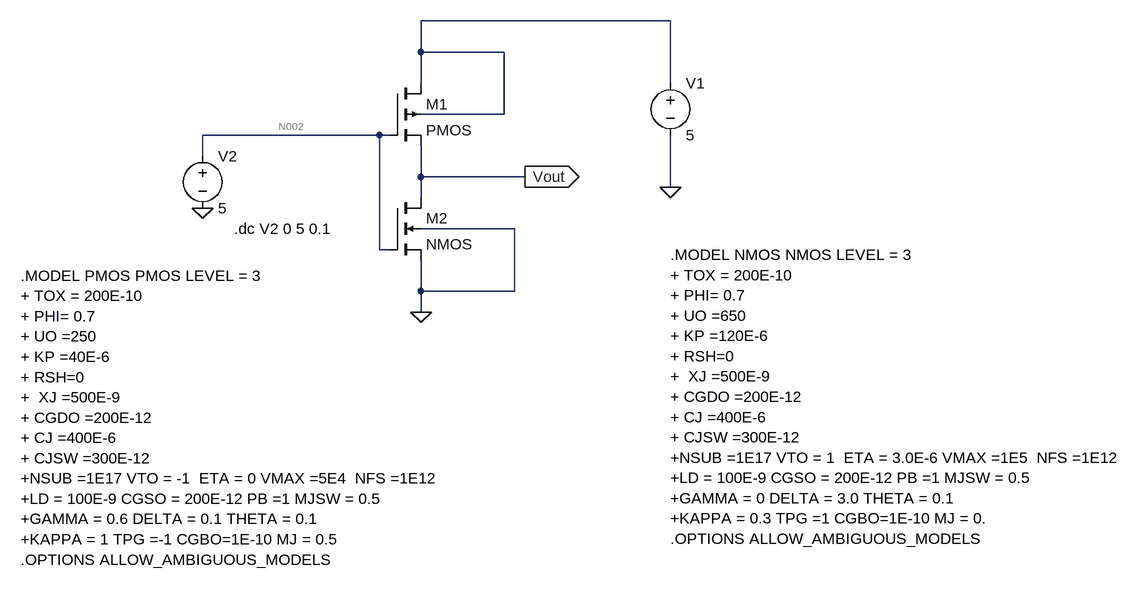
[diagram p0: schematic Voltage Transfer Characteristic curve of CMOS.asc]
Voltage Transfer Characteristic curve of CMOS.asc, the LTspice schematic file:
Version 4.1
SHEET 1 1332 752
WIRE 608 -48 224 -48
WIRE 224 0 224 -48
WIRE 352 0 224 0
WIRE 224 48 224 0
WIRE 608 48 608 -48
WIRE 352 96 352 0
WIRE 352 96 224 96
WIRE 160 128 -112 128
WIRE 176 128 160 128
WIRE -112 160 -112 128
WIRE 224 192 224 144
WIRE 384 192 224 192
WIRE 608 208 608 128
WIRE 224 224 224 192
WIRE 368 272 224 272
WIRE 160 304 160 128
WIRE 176 304 160 304
WIRE 224 368 224 320
WIRE 368 368 368 272
WIRE 368 368 224 368
WIRE 224 400 224 368
FLAG 224 400 0
FLAG 608 208 0
FLAG -112 240 0
FLAG 384 192 Vout
IOPIN 384 192 Out
SYMBOL pmos4 176 48 R0
SYMATTR InstName M1
SYMATTR Value2 l=400u w=10u
SYMBOL nmos4 176 224 R0
SYMATTR InstName M2
SYMATTR Value2 l=100u w=10u
SYMBOL voltage 608 32 R0
WINDOW 123 0 0 Left 0
WINDOW 39 0 0 Left 0
SYMATTR InstName V1
SYMATTR Value 5
SYMBOL voltage -112 144 R0
WINDOW 123 0 0 Left 0
WINDOW 39 0 0 Left 0
SYMATTR InstName V2
SYMATTR Value 5
TEXT -392 344 Left 2 !.MODEL PMOS PMOS LEVEL = 3\n+ TOX = 200E-10\n+ PHI= 0.7\n+ UO =250\n+ KP =40E-6\n+ RSH=0\n+  XJ =500E-9\n+ CGDO =200E-12\n+ CJ =400E-6\n+ CJSW =300E-12\n+NSUB =1E17 VTO = -1  ETA = 0 VMAX =5E4  NFS =1E12\n+LD = 100E-9 CGSO = 200E-12 PB =1 MJSW = 0.5\n+GAMMA = 0.6 DELTA = 0.1 THETA = 0.1\n+KAPPA = 1 TPG =-1 CGBO=1E-10 MJ = 0.5\n.OPTIONS ALLOW_AMBIGUOUS_MODELS
TEXT 608 312 Left 2 !.MODEL NMOS NMOS LEVEL = 3\n+ TOX = 200E-10\n+ PHI= 0.7\n+ UO =650\n+ KP =120E-6\n+ RSH=0\n+  XJ =500E-9\n+ CGDO =200E-12\n+ CJ =400E-6\n+ CJSW =300E-12\n+NSUB =1E17 VTO = 1  ETA = 3.0E-6 VMAX =1E5  NFS =1E12\n+LD = 100E-9 CGSO = 200E-12 PB =1 MJSW = 0.5\n+GAMMA = 0 DELTA = 3.0 THETA = 0.1\n+KAPPA = 0.3 TPG =1 CGBO=1E-10 MJ = 0.\n.OPTIONS ALLOW_AMBIGUOUS_MODELS
TEXT -64 272 Left 2 !.dc V2 0 5 0.1

The netlist it stands for:
* Voltage Transfer Characteristic curve of CMOS.asc
M1 N001 N002 Vout N001 PMOS l=400u w=10u
M2 Vout N002 0 0 NMOS l=100u w=10u
V1 N001 0 5
V2 N002 0 5
.model NMOS NMOS
.model PMOS PMOS
.lib standard.mos
.MODEL PMOS PMOS LEVEL = 3
+ TOX = 200E-10
+ PHI= 0.7
+ UO =250
+ KP =40E-6
+ RSH=0
+  XJ =500E-9
+ CGDO =200E-12
+ CJ =400E-6
+ CJSW =300E-12
+NSUB =1E17 VTO = -1  ETA = 0 VMAX =5E4  NFS =1E12
+LD = 100E-9 CGSO = 200E-12 PB =1 MJSW = 0.5
+GAMMA = 0.6 DELTA = 0.1 THETA = 0.1
+KAPPA = 1 TPG =-1 CGBO=1E-10 MJ = 0.5
.OPTIONS ALLOW_AMBIGUOUS_MODELS
.MODEL NMOS NMOS LEVEL = 3
+ TOX = 200E-10
+ PHI= 0.7
+ UO =650
+ KP =120E-6
+ RSH=0
+  XJ =500E-9
+ CGDO =200E-12
+ CJ =400E-6
+ CJSW =300E-12
+NSUB =1E17 VTO = 1  ETA = 3.0E-6 VMAX =1E5  NFS =1E12
+LD = 100E-9 CGSO = 200E-12 PB =1 MJSW = 0.5
+GAMMA = 0 DELTA = 3.0 THETA = 0.1
+KAPPA = 0.3 TPG =1 CGBO=1E-10 MJ = 0.
.OPTIONS ALLOW_AMBIGUOUS_MODELS
.dc V2 0 5 0.1
.backanno
.end

* Results of the author's LTspice run, read from the files saved beside the schematic
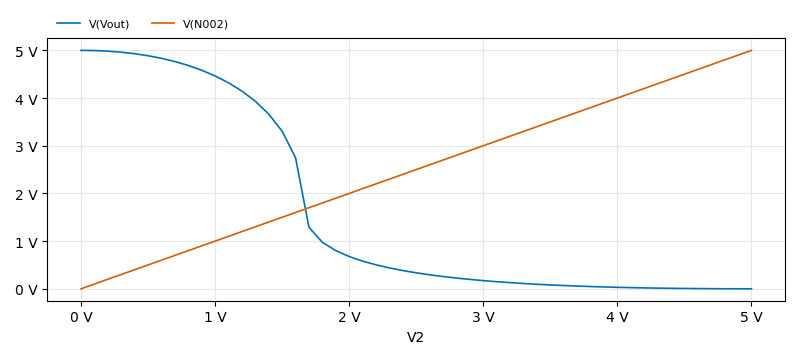
[diagram p1: DC transfer characteristic of Voltage Transfer Characteristic curve of CMOS.asc, plotted from the saved traces]
* DC transfer characteristic, 1 run:
*   V(Vout): 5 V at V2=0 V, 972.7 nV at V2=5 V, min 972.7 nV, max 5 V
*   V(N002): 0 V at V2=0 V, 5 V at V2=5 V, min 0 V, max 5 V